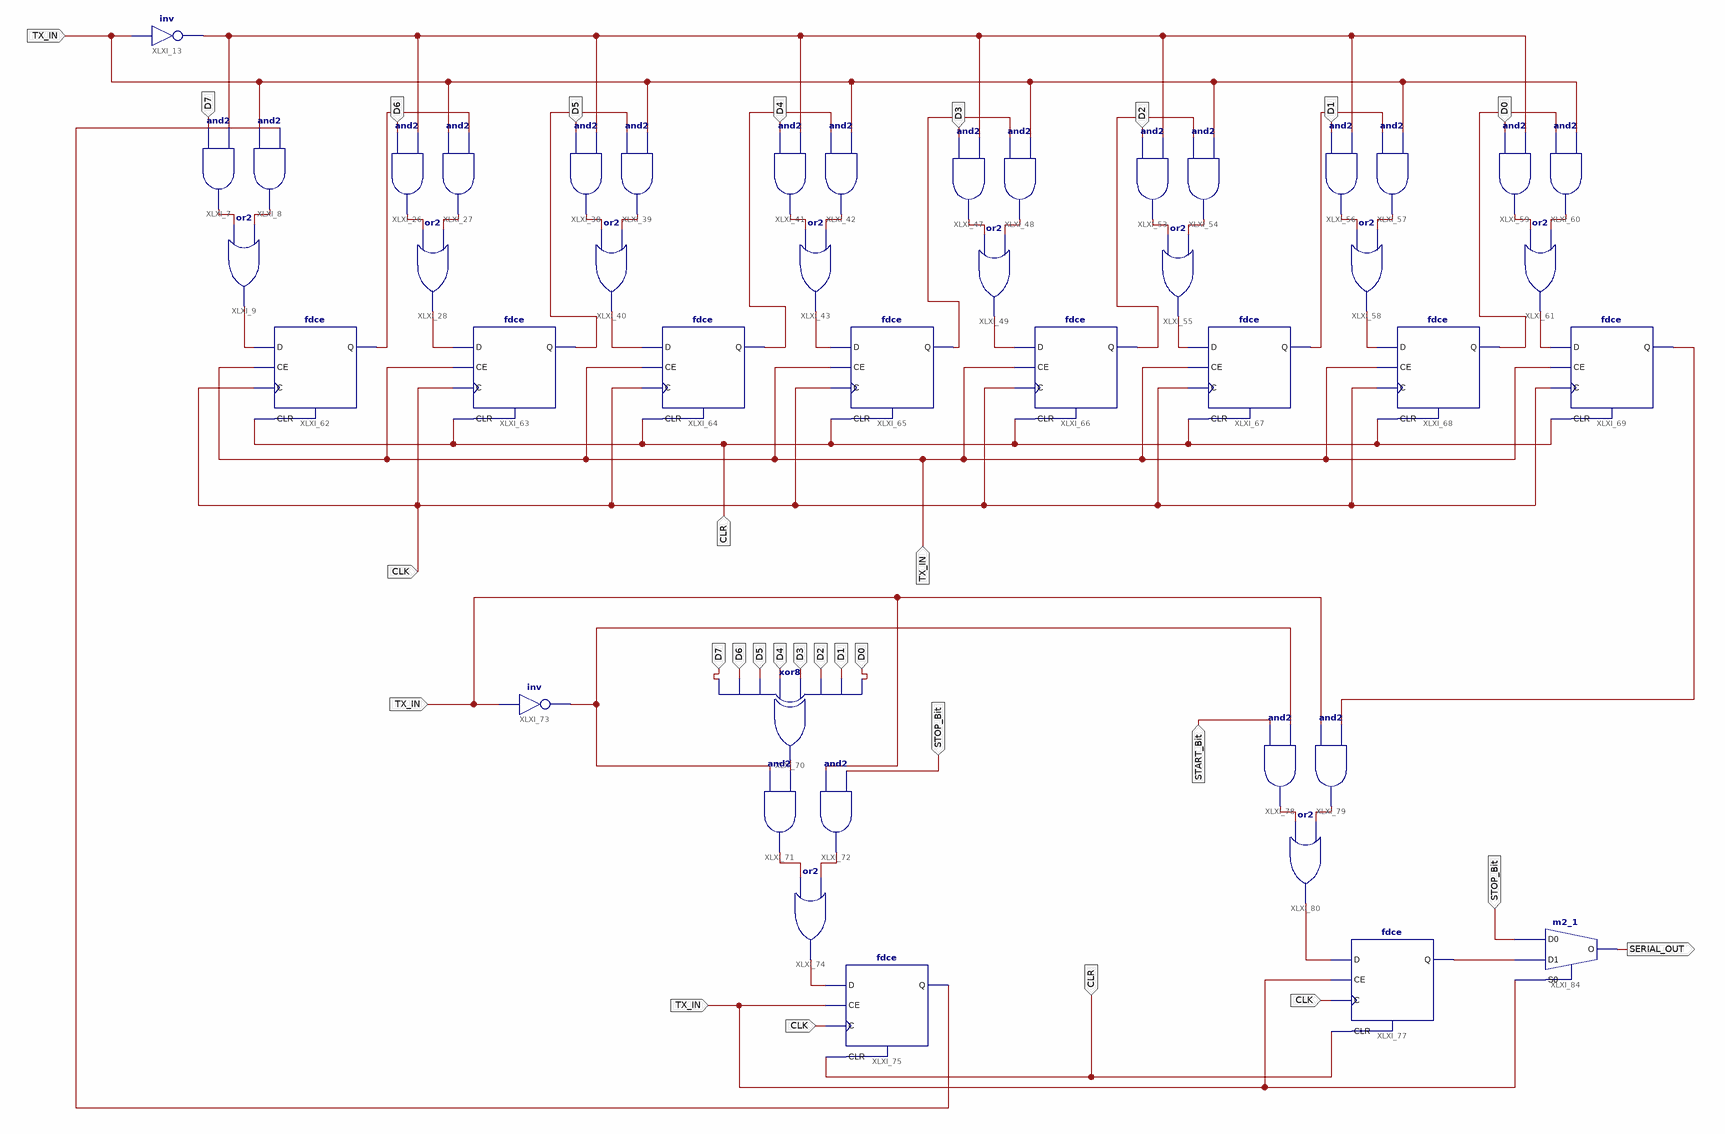
[diagram p0: schematic sheet 1]
// Xilinx ISE schematic PISO.sch (spartan3e) as structural Verilog: 44 symbols, 14 ports
module PISO (
  input  TX_IN,
  input  D7,
  input  D6,
  input  D5,
  input  D4,
  input  D3,
  input  D2,
  input  D1,
  input  D0,
  input  CLK,
  input  STOP_Bit,
  input  START_Bit,
  input  CLR,
  output SERIAL_OUT
);

  wire XLXN_10, XLXN_11, XLXN_17, XLXN_19, XLXN_22, XLXN_23, XLXN_30, XLXN_31, XLXN_32, XLXN_33, XLXN_34,
       XLXN_35, XLXN_36, XLXN_39, XLXN_40, XLXN_41, XLXN_44, XLXN_45, XLXN_46, XLXN_47, XLXN_48, XLXN_49,
       XLXN_50, XLXN_51, XLXN_53, XLXN_54, XLXN_56, XLXN_57, XLXN_58, XLXN_59, XLXN_60, XLXN_61, XLXN_105,
       XLXN_108, XLXN_114, XLXN_115, XLXN_116, XLXN_118, XLXN_120, XLXN_121, XLXN_122, XLXN_129, XLXN_133;

  not XLXI_13 (XLXN_17, TX_IN);
  and XLXI_7 (XLXN_10, D7, XLXN_17);
  and XLXI_8 (XLXN_11, TX_IN, XLXN_118);
  or XLXI_9 (XLXN_19, XLXN_10, XLXN_11);
  and XLXI_26 (XLXN_22, D6, XLXN_17);
  and XLXI_27 (XLXN_23, TX_IN, XLXN_31);
  or XLXI_28 (XLXN_30, XLXN_22, XLXN_23);
  and XLXI_38 (XLXN_32, D5, XLXN_17);
  and XLXI_39 (XLXN_33, XLXN_34, TX_IN);
  or XLXI_40 (XLXN_61, XLXN_32, XLXN_33);
  and XLXI_41 (XLXN_35, D4, XLXN_17);
  and XLXI_42 (XLXN_36, XLXN_39, TX_IN);
  or XLXI_43 (XLXN_60, XLXN_35, XLXN_36);
  and XLXI_47 (XLXN_40, D3, XLXN_17);
  and XLXI_48 (XLXN_41, XLXN_50, TX_IN);
  or XLXI_49 (XLXN_58, XLXN_40, XLXN_41);
  and XLXI_53 (XLXN_44, D2, XLXN_17);
  and XLXI_54 (XLXN_45, XLXN_51, TX_IN);
  or XLXI_55 (XLXN_59, XLXN_44, XLXN_45);
  and XLXI_56 (XLXN_46, D1, XLXN_17);
  and XLXI_57 (XLXN_47, XLXN_53, TX_IN);
  or XLXI_58 (XLXN_56, XLXN_46, XLXN_47);
  and XLXI_59 (XLXN_48, D0, XLXN_17);
  and XLXI_60 (XLXN_49, XLXN_54, TX_IN);
  or XLXI_61 (XLXN_57, XLXN_48, XLXN_49);
  fdce XLXI_62 (.C(CLK), .CE(TX_IN), .CLR(CLR), .D(XLXN_19), .Q(XLXN_31));
  fdce XLXI_63 (.C(CLK), .CE(TX_IN), .CLR(CLR), .D(XLXN_30), .Q(XLXN_34));
  fdce XLXI_64 (.C(CLK), .CE(TX_IN), .CLR(CLR), .D(XLXN_61), .Q(XLXN_39));
  fdce XLXI_65 (.C(CLK), .CE(TX_IN), .CLR(CLR), .D(XLXN_60), .Q(XLXN_50));
  fdce XLXI_66 (.C(CLK), .CE(TX_IN), .CLR(CLR), .D(XLXN_58), .Q(XLXN_51));
  fdce XLXI_67 (.C(CLK), .CE(TX_IN), .CLR(CLR), .D(XLXN_59), .Q(XLXN_53));
  fdce XLXI_68 (.C(CLK), .CE(TX_IN), .CLR(CLR), .D(XLXN_56), .Q(XLXN_54));
  fdce XLXI_69 (.C(CLK), .CE(TX_IN), .CLR(CLR), .D(XLXN_57), .Q(XLXN_129));
  xor XLXI_70 (XLXN_105, D7, D6, D5, D4, D3, D2, D1, D0);
  and XLXI_71 (XLXN_114, XLXN_108, XLXN_105);
  and XLXI_72 (XLXN_115, TX_IN, STOP_Bit);
  not XLXI_73 (XLXN_108, TX_IN);
  or XLXI_74 (XLXN_116, XLXN_114, XLXN_115);
  fdce XLXI_75 (.C(CLK), .CE(TX_IN), .CLR(CLR), .D(XLXN_116), .Q(XLXN_118));
  and XLXI_78 (XLXN_120, START_Bit, XLXN_108);
  and XLXI_79 (XLXN_121, TX_IN, XLXN_129);
  or XLXI_80 (XLXN_122, XLXN_120, XLXN_121);
  fdce XLXI_77 (.C(CLK), .CE(TX_IN), .CLR(CLR), .D(XLXN_122), .Q(XLXN_133));
  m2_1 XLXI_84 (.D0(STOP_Bit), .D1(XLXN_133), .S0(TX_IN), .O(SERIAL_OUT));
endmodule
